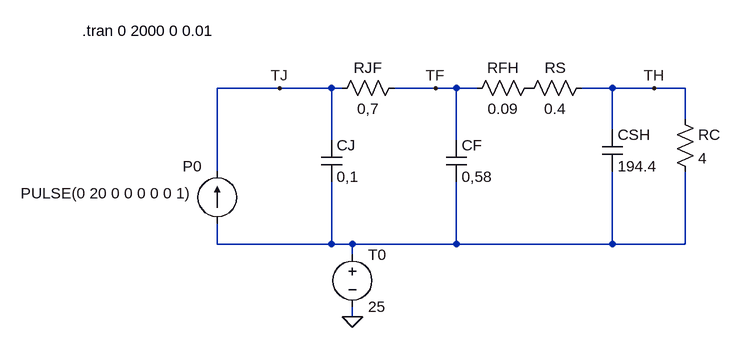
[diagram p0: schematic Draft2.asc]
Draft2.asc, the LTspice schematic file:
Version 4
SHEET 1 880 680
WIRE -144 48 -240 48
WIRE -64 48 -144 48
WIRE -48 48 -64 48
WIRE 96 48 32 48
WIRE 128 48 96 48
WIRE 160 48 128 48
WIRE 368 48 320 48
WIRE 432 48 368 48
WIRE 480 48 432 48
WIRE 480 96 480 48
WIRE 368 112 368 48
WIRE -64 128 -64 48
WIRE 128 128 128 48
WIRE -240 176 -240 48
WIRE -240 288 -240 256
WIRE -64 288 -64 192
WIRE -64 288 -240 288
WIRE -32 288 -64 288
WIRE 128 288 128 192
WIRE 128 288 -32 288
WIRE 368 288 368 176
WIRE 368 288 128 288
WIRE 480 288 480 176
WIRE 480 288 368 288
WIRE -32 304 -32 288
WIRE -32 400 -32 384
FLAG -32 400 0
FLAG 432 48 TH
FLAG -144 48 TJ
FLAG 96 48 TF
SYMBOL res -64 64 R270
WINDOW 0 32 56 VTop 0
WINDOW 3 0 56 VBottom 0
SYMATTR InstName RJF
SYMATTR Value 0,7
SYMBOL res 464 80 R0
SYMATTR InstName RC
SYMATTR Value 4
SYMBOL voltage -32 288 R0
WINDOW 123 0 0 Left 0
WINDOW 39 0 0 Left 0
SYMATTR InstName T0
SYMATTR Value 25
SYMBOL current -240 256 R180
WINDOW 0 24 88 Left 0
WINDOW 3 39 46 Left 0
WINDOW 123 0 0 Left 0
WINDOW 39 0 0 Left 0
SYMATTR InstName P0
SYMATTR Value PULSE(0 20 0 0 0 0 0 1)
SYMBOL res 144 64 R270
WINDOW 0 32 56 VTop 0
WINDOW 3 0 56 VBottom 0
SYMATTR InstName RFH
SYMATTR Value 0.09
SYMBOL res 224 64 R270
WINDOW 0 32 56 VTop 0
WINDOW 3 0 56 VBottom 0
SYMATTR InstName RS
SYMATTR Value 0.4
SYMBOL cap -80 128 R0
SYMATTR InstName CJ
SYMATTR Value 0,1
SYMBOL cap 112 128 R0
SYMATTR InstName CF
SYMATTR Value 0,58
SYMBOL cap 352 112 R0
SYMATTR InstName CSH
SYMATTR Value 194.4
TEXT -448 -40 Left 0 !.tran 0 2000 0 0.01

The netlist it stands for:
* Draft2.asc
RJF TJ TF 0,7
RC TH N001 4
V§T0 N001 0 25
I§P0 N001 TJ PULSE(0 20 0 0 0 0 0 1)
RFH TF P001 0.09
RS P001 TH 0.4
CJ TJ N001 0,1
CF TF N001 0,58
CSH TH N001 194.4
.tran 0 2000 0 0.01
.backanno
.end